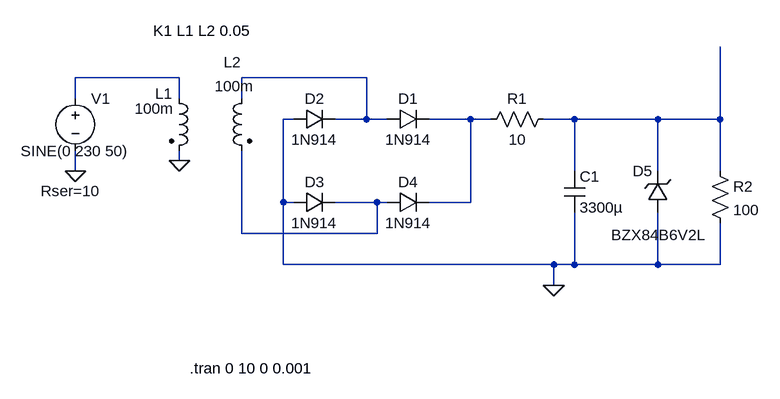
[diagram p0: schematic Power Supply.asc]
Power Supply.asc, the LTspice schematic file:
Version 4
SHEET 1 880 680
WIRE -224 -16 -384 -16
WIRE 64 -16 -128 -16
WIRE -384 16 -384 -16
WIRE -224 16 -224 -16
WIRE -128 16 -128 -16
WIRE -48 48 -64 48
WIRE 64 48 64 -16
WIRE 64 48 16 48
WIRE 96 48 64 48
WIRE 224 48 160 48
WIRE 256 48 224 48
WIRE 384 48 336 48
WIRE 512 48 384 48
WIRE 608 48 608 -64
WIRE 608 48 512 48
WIRE -224 112 -224 96
WIRE -384 128 -384 96
WIRE 384 128 384 48
WIRE 512 128 512 48
WIRE 608 128 608 48
WIRE -64 176 -64 48
WIRE -48 176 -64 176
WIRE 80 176 16 176
WIRE 96 176 80 176
WIRE 224 176 224 48
WIRE 224 176 160 176
WIRE -128 224 -128 96
WIRE 80 224 80 176
WIRE 80 224 -128 224
WIRE -64 272 -64 176
WIRE 352 272 -64 272
WIRE 384 272 384 192
WIRE 384 272 352 272
WIRE 512 272 512 192
WIRE 512 272 384 272
WIRE 608 272 608 208
WIRE 608 272 512 272
WIRE 352 304 352 272
FLAG -384 128 0
FLAG -224 112 0
FLAG 352 304 0
SYMBOL voltage -384 0 R0
WINDOW 123 0 0 Left 0
WINDOW 39 -53 159 Left 2
WINDOW 3 -84 97 Left 2
SYMATTR SpiceLine Rser=10
SYMATTR Value SINE(0 230 50)
SYMATTR InstName V1
SYMBOL ind2 -240 0 R0
WINDOW 0 -21 9 Left 2
WINDOW 3 -53 32 Left 2
SYMATTR InstName L1
SYMATTR Value 100m
SYMATTR Type ind
SYMBOL ind2 -112 0 M0
WINDOW 0 17 -40 Left 2
WINDOW 3 -3 -3 Left 2
SYMATTR InstName L2
SYMATTR Value 100m
SYMATTR Type ind
SYMBOL diode 96 64 R270
WINDOW 0 32 32 VTop 2
WINDOW 3 0 32 VBottom 2
SYMATTR InstName D1
SYMATTR Value 1N914
SYMBOL diode -48 64 R270
WINDOW 0 32 32 VTop 2
WINDOW 3 0 32 VBottom 2
SYMATTR InstName D2
SYMATTR Value 1N914
SYMBOL diode -48 192 R270
WINDOW 0 32 32 VTop 2
WINDOW 3 0 32 VBottom 2
SYMATTR InstName D3
SYMATTR Value 1N914
SYMBOL diode 96 192 R270
WINDOW 0 32 32 VTop 2
WINDOW 3 0 32 VBottom 2
SYMATTR InstName D4
SYMATTR Value 1N914
SYMBOL res 240 64 R270
WINDOW 0 32 56 VTop 2
WINDOW 3 0 56 VBottom 2
SYMATTR InstName R1
SYMATTR Value 10
SYMBOL cap 368 128 R0
SYMATTR InstName C1
SYMATTR Value 3300µ
SYMBOL zener 528 192 R180
WINDOW 0 24 64 Left 2
WINDOW 3 -58 -34 Left 2
SYMATTR InstName D5
SYMATTR Value BZX84B6V2L
SYMBOL res 592 112 R0
SYMATTR InstName R2
SYMATTR Value 100
TEXT -208 432 Left 2 !.tran 0 10 0 0.001
TEXT -264 -88 Left 2 !K1 L1 L2 0.05

The netlist it stands for:
* Power Supply.asc
V1 N001 0 SINE(0 230 50) Rser=10
L1 N001 0 100m
L2 N002 N005 100m
D1 N002 N003 1N914
D2 0 N002 1N914
D3 0 N005 1N914
D4 N005 N003 1N914
R1 N003 N004 10
C1 N004 0 3300µ
D5 0 N004 BZX84B6V2L
R2 N004 0 100
.model D D
.lib standard.dio
.tran 0 10 0 0.001
K1 L1 L2 0.05
.backanno
.end